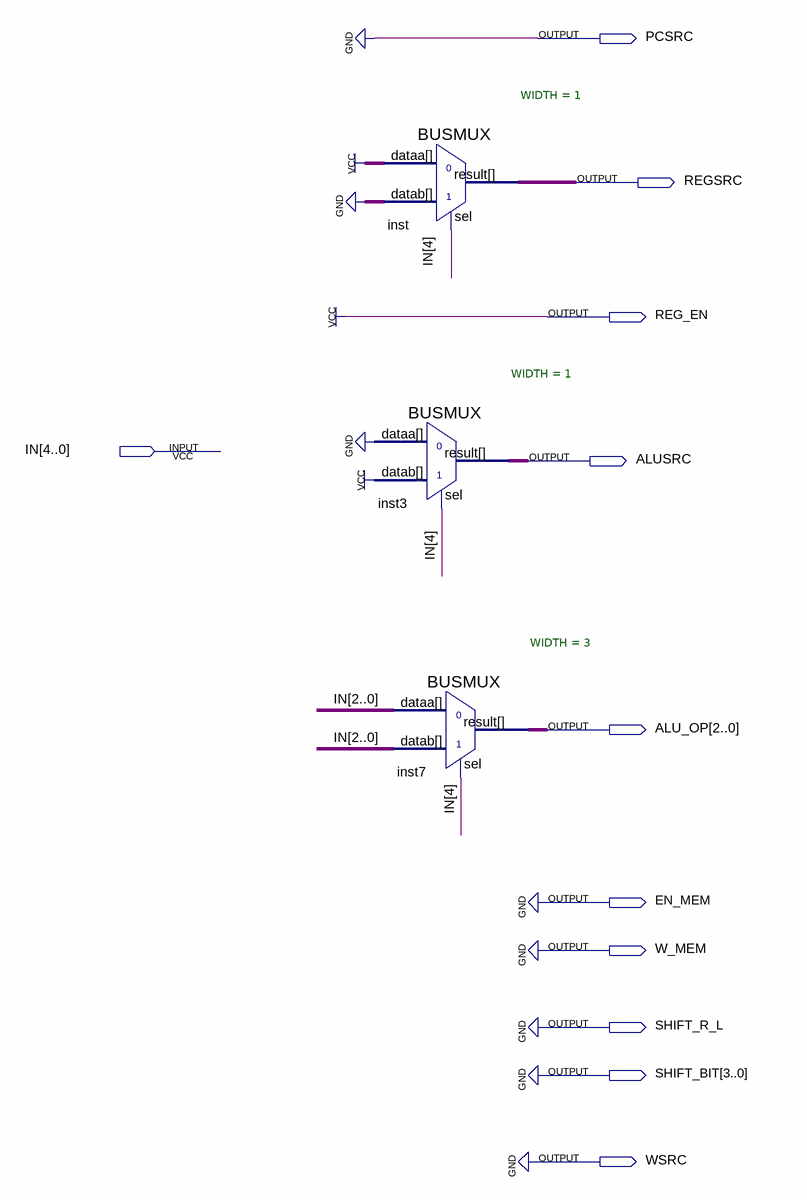
[diagram p0: schematic sheet]
// Quartus schematic CONTROL.bdf as structural Verilog: 3 symbols, 11 pins
module CONTROL (
  input  [4:0] IN,
  output PCSRC,
  output REGSRC,
  output REG_EN,
  output ALUSRC,
  output [2:0] ALU_OP,
  output EN_MEM,
  output W_MEM,
  output SHIFT_R_L,
  output [3:0] SHIFT_BIT,
  output WSRC
);

  BUSMUX #(.WIDTH(1)) inst (.datab(1'b0), .sel(IN[4]), .dataa(1'b1), .result(REGSRC));
  BUSMUX #(.WIDTH(1)) inst3 (.datab(1'b1), .sel(IN[4]), .dataa(1'b0), .result(ALUSRC));
  BUSMUX #(.WIDTH(3)) inst7 (.datab(IN[2:0]), .sel(IN[4]), .dataa(IN[2:0]), .result(ALU_OP));

  assign EN_MEM = 1'b0;
  assign PCSRC = 1'b0;
  assign REG_EN = 1'b1;
  assign SHIFT_BIT = 4'b0000;
  assign SHIFT_R_L = 1'b0;
  assign W_MEM = 1'b0;
  assign WSRC = 1'b0;
endmodule
